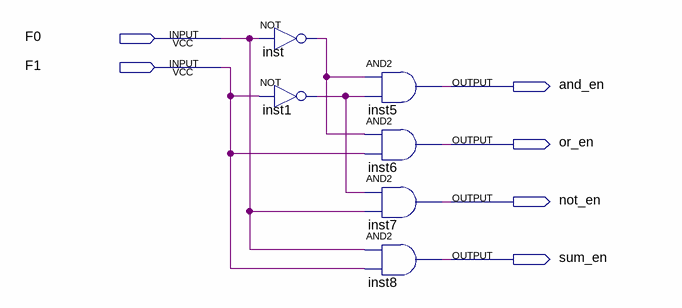
[diagram p0: schematic sheet]
// Quartus schematic DECODER2_4.bdf as structural Verilog: 6 symbols, 6 pins
module DECODER2_4 (
  input  F0,
  input  F1,
  output and_en,
  output or_en,
  output not_en,
  output sum_en
);

  wire inst1_out, inst_out;

  not inst (inst_out, F0);
  not inst1 (inst1_out, F1);
  and inst5 (and_en, inst_out, inst1_out);
  and inst6 (or_en, inst_out, F1);
  and inst7 (not_en, inst1_out, F0);
  and inst8 (sum_en, F0, F1);
endmodule
